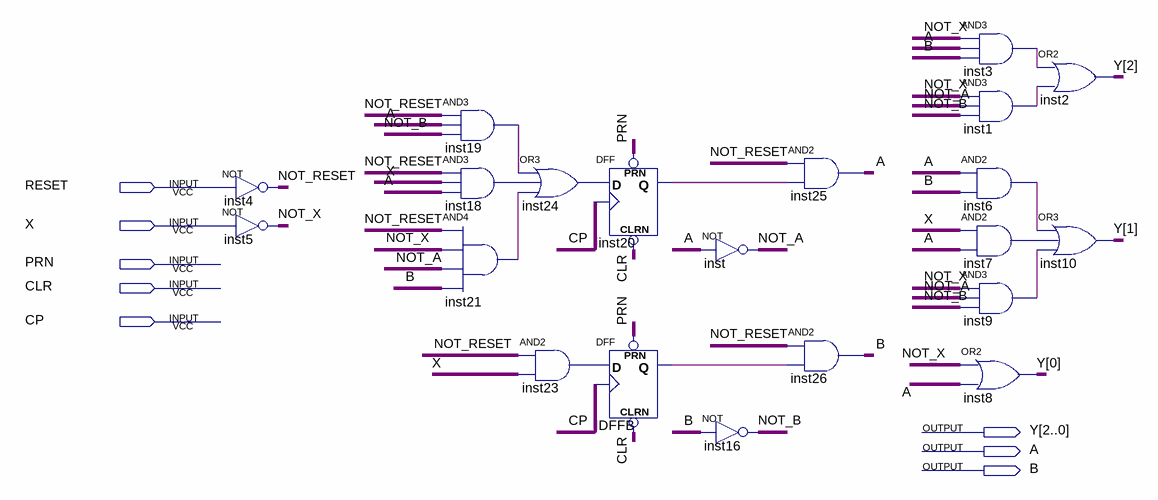
[diagram p0: schematic sheet]
// Quartus schematic Problem2.bdf as structural Verilog: 21 symbols, 8 pins
module Problem2 (
  input  RESET,
  input  X,
  input  PRN,
  input  CLR,
  input  CP,
  output [2:0] Y,
  output A,
  output B
);

  wire DFFB_q, inst1_out, inst3_out, inst6_out, inst7_out, inst9_out, inst18_out, inst19_out, inst20_q,
       inst21_out, inst23_out, inst24_out, NOT_A, NOT_B, NOT_RESET, NOT_X;

  not inst4 (NOT_RESET, RESET);
  not inst5 (NOT_X, X);
  and inst19 (inst19_out, NOT_RESET, A, NOT_B);
  and inst18 (inst18_out, NOT_RESET, X, A);
  and inst21 (inst21_out, NOT_RESET, NOT_X, NOT_A, B);
  or inst24 (inst24_out, inst19_out, inst18_out, inst21_out);
  and inst23 (inst23_out, NOT_RESET, X);
  DFF inst20 (.CLRN(CLR), .CLK(CP), .D(inst24_out), .PRN(PRN), .Q(inst20_q));
  DFF DFFB (.CLRN(CLR), .CLK(CP), .D(inst23_out), .PRN(PRN), .Q(DFFB_q));
  not inst (NOT_A, A);
  not inst16 (NOT_B, B);
  and inst25 (A, NOT_RESET, inst20_q);
  and inst26 (B, NOT_RESET, DFFB_q);
  and inst3 (inst3_out, NOT_X, A, B);
  and inst1 (inst1_out, NOT_X, NOT_A, NOT_B);
  and inst6 (inst6_out, A, B);
  and inst7 (inst7_out, X, A);
  and inst9 (inst9_out, NOT_X, NOT_A, NOT_B);
  or inst8 (Y[0], NOT_X, A);
  or inst2 (Y[2], inst3_out, inst1_out);
  or inst10 (Y[1], inst6_out, inst7_out, inst9_out);
endmodule
